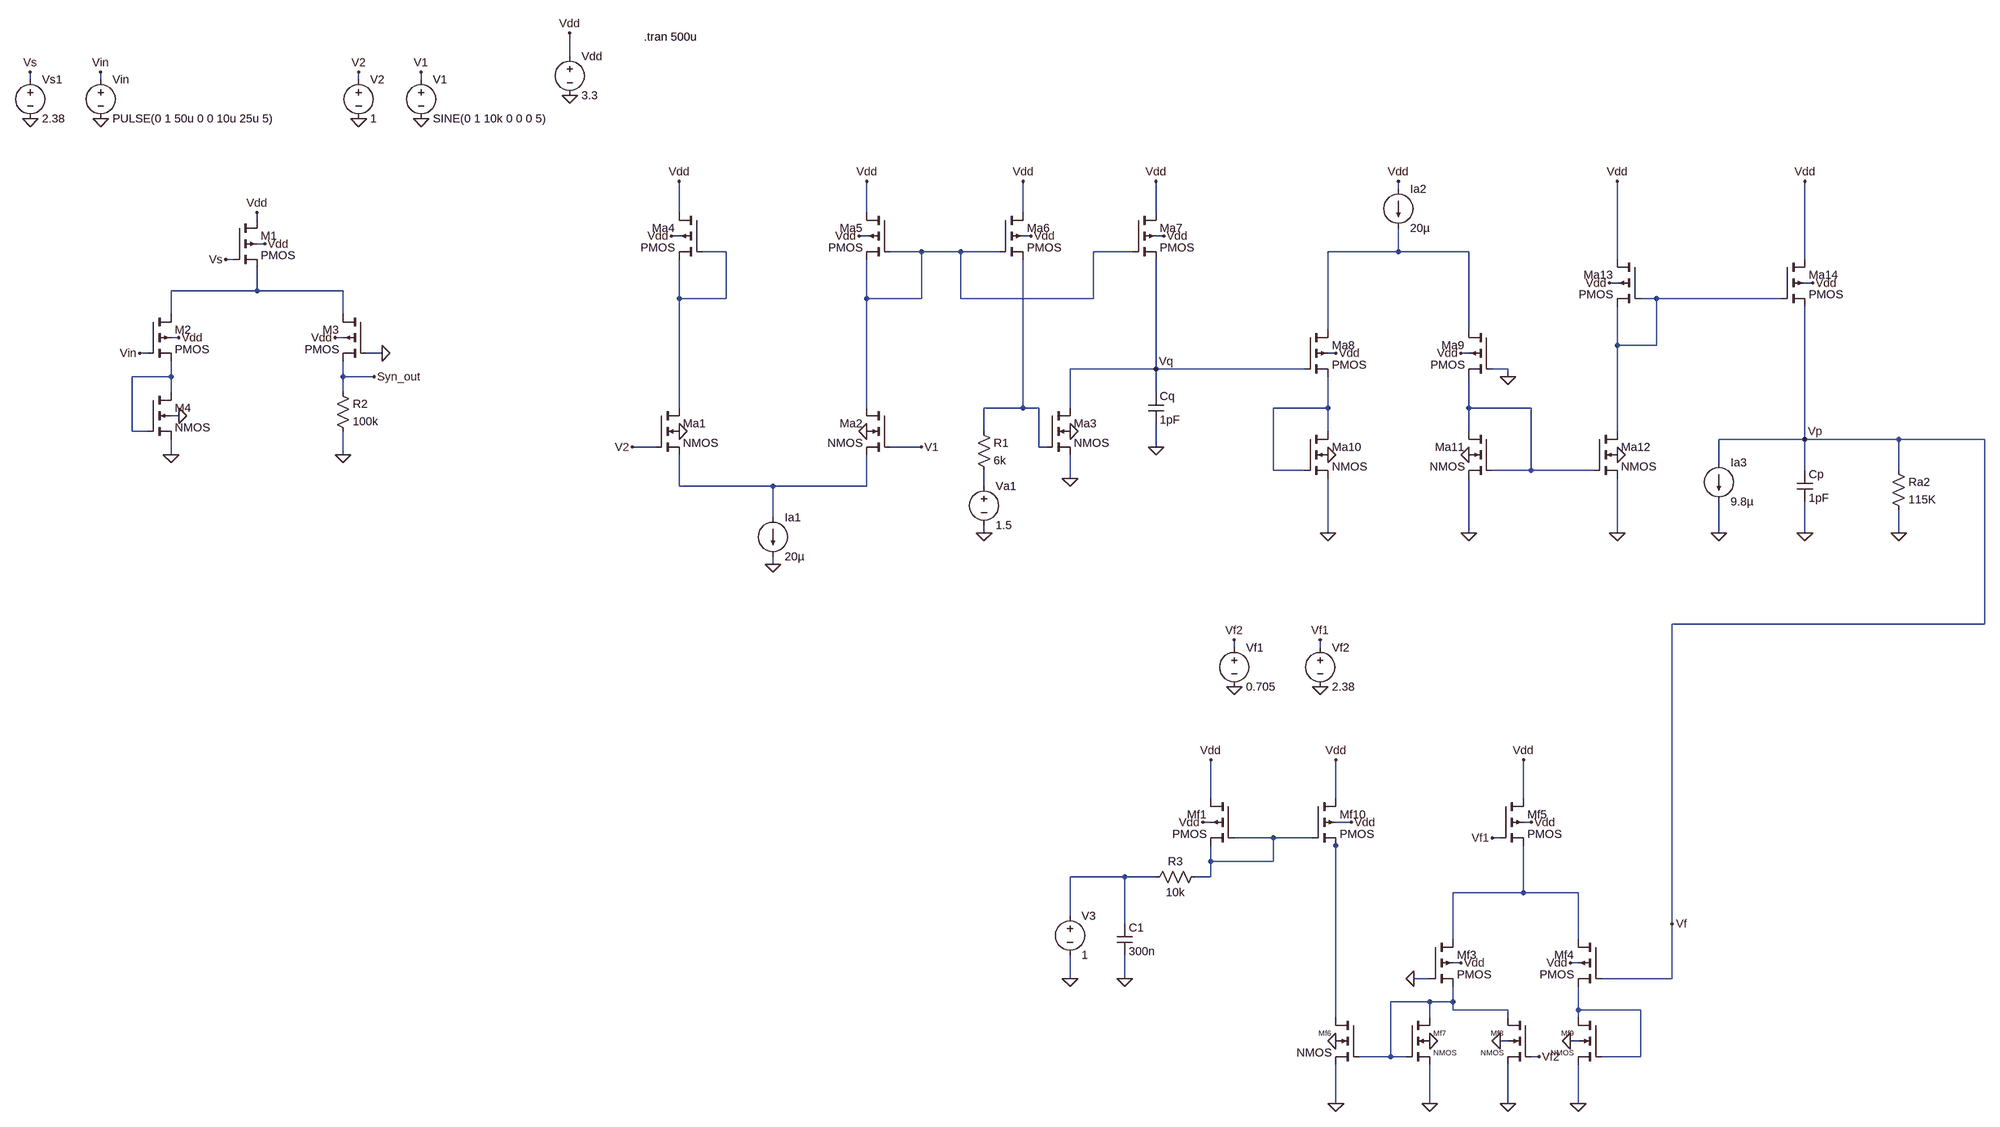
[diagram p0: schematic Astrocyte(l=50n).asc]
Astrocyte(l=50n).asc, the LTspice schematic file:
Version 4
SHEET 1 2788 2352
WIRE -112 -160 -112 -208
WIRE -1216 -112 -1216 -128
WIRE -1072 -112 -1072 -128
WIRE -544 -112 -544 -128
WIRE -416 -112 -416 -128
WIRE 1584 112 1584 96
WIRE 112 160 112 96
WIRE 496 160 496 96
WIRE 816 160 816 96
WIRE 1088 160 1088 96
WIRE -752 176 -752 160
WIRE 112 208 96 208
WIRE 496 208 480 208
WIRE 832 208 816 208
WIRE 1104 208 1088 208
WIRE -736 224 -752 224
WIRE 208 240 160 240
WIRE 608 240 544 240
WIRE 688 240 608 240
WIRE 768 240 688 240
WIRE 1040 240 960 240
WIRE 1584 240 1584 192
WIRE 1584 240 1440 240
WIRE 1728 240 1584 240
WIRE -800 256 -816 256
WIRE 2032 256 2032 96
WIRE 2416 256 2416 96
WIRE 2032 304 2016 304
WIRE 2432 304 2416 304
WIRE -752 320 -752 272
WIRE -752 320 -928 320
WIRE -576 320 -752 320
WIRE 112 336 112 256
WIRE 208 336 208 240
WIRE 208 336 112 336
WIRE 496 336 496 256
WIRE 608 336 608 240
WIRE 608 336 496 336
WIRE 688 336 688 240
WIRE 960 336 960 240
WIRE 960 336 688 336
WIRE 2112 336 2080 336
WIRE 2368 336 2112 336
WIRE -928 368 -928 320
WIRE -576 368 -576 320
WIRE 1440 400 1440 240
WIRE 1728 400 1728 240
WIRE -912 416 -928 416
WIRE -576 416 -592 416
WIRE 2032 432 2032 352
WIRE 2112 432 2112 336
WIRE 2112 432 2032 432
WIRE -976 448 -992 448
WIRE -496 448 -528 448
WIRE 1456 448 1440 448
WIRE 1728 448 1712 448
WIRE 1088 480 1088 256
WIRE 1088 480 912 480
WIRE 1392 480 1088 480
WIRE 1808 480 1776 480
WIRE -928 496 -928 464
WIRE -928 496 -1008 496
WIRE -576 496 -576 464
WIRE -512 496 -576 496
WIRE 1808 496 1808 480
WIRE -928 528 -928 496
WIRE -576 528 -576 496
WIRE 1088 528 1088 480
WIRE 112 560 112 336
WIRE 496 560 496 336
WIRE 816 560 816 256
WIRE 816 560 736 560
WIRE 848 560 816 560
WIRE 912 560 912 480
WIRE 1440 560 1440 496
WIRE 1440 560 1328 560
WIRE 1728 560 1728 496
WIRE 1856 560 1728 560
WIRE -912 576 -928 576
WIRE -1008 608 -1008 496
WIRE -976 608 -1008 608
WIRE 736 608 736 560
WIRE 1440 608 1440 560
WIRE 1728 608 1728 560
WIRE 2032 608 2032 432
WIRE 2416 624 2416 352
WIRE 2416 624 2240 624
WIRE 2608 624 2416 624
WIRE 2784 624 2608 624
WIRE 64 640 16 640
WIRE 608 640 544 640
WIRE 848 640 848 560
WIRE 864 640 848 640
WIRE 1088 640 1088 592
WIRE -928 656 -928 624
WIRE -576 656 -576 608
WIRE 2240 672 2240 624
WIRE 1328 688 1328 560
WIRE 1392 688 1328 688
WIRE 1856 688 1856 560
WIRE 1856 688 1776 688
WIRE 1984 688 1856 688
WIRE 2416 688 2416 624
WIRE 2608 688 2608 624
WIRE 912 704 912 656
WIRE 112 720 112 656
WIRE 304 720 112 720
WIRE 496 720 496 656
WIRE 496 720 304 720
WIRE 736 720 736 688
WIRE 304 784 304 720
WIRE 736 816 736 800
WIRE 1440 816 1440 704
WIRE 1728 816 1728 704
WIRE 2032 816 2032 704
WIRE 2240 816 2240 752
WIRE 2416 816 2416 752
WIRE 2608 816 2608 768
WIRE 304 880 304 864
WIRE 2784 1296 2784 624
WIRE 2784 1296 2144 1296
WIRE 1248 1344 1248 1328
WIRE 1424 1344 1424 1328
WIRE 1200 1712 1200 1632
WIRE 1456 1712 1456 1632
WIRE 1840 1712 1840 1632
WIRE 1200 1760 1184 1760
WIRE 1488 1760 1456 1760
WIRE 1856 1760 1840 1760
WIRE 1328 1792 1248 1792
WIRE 1408 1792 1328 1792
WIRE 1792 1792 1776 1792
WIRE 1456 1808 1456 1792
WIRE 1200 1840 1200 1808
WIRE 1328 1840 1328 1792
WIRE 1328 1840 1200 1840
WIRE 1024 1872 912 1872
WIRE 1088 1872 1024 1872
WIRE 1200 1872 1200 1840
WIRE 1200 1872 1168 1872
WIRE 1840 1904 1840 1808
WIRE 1840 1904 1696 1904
WIRE 1952 1904 1840 1904
WIRE 912 1952 912 1872
WIRE 1024 1968 1024 1872
WIRE 2144 1968 2144 1296
WIRE 1696 2000 1696 1904
WIRE 1952 2000 1952 1904
WIRE 1712 2048 1696 2048
WIRE 1952 2048 1936 2048
WIRE 912 2080 912 2032
WIRE 1024 2080 1024 2032
WIRE 1648 2080 1616 2080
WIRE 2144 2080 2144 1968
WIRE 2144 2080 2000 2080
WIRE 1648 2128 1568 2128
WIRE 1696 2128 1696 2096
WIRE 1696 2128 1648 2128
WIRE 1696 2144 1696 2128
WIRE 1808 2144 1696 2144
WIRE 1952 2144 1952 2096
WIRE 2080 2144 1952 2144
WIRE 1456 2160 1456 1808
WIRE 1648 2160 1648 2128
WIRE 1808 2160 1808 2144
WIRE 1952 2160 1952 2144
WIRE 1808 2208 1792 2208
WIRE 1952 2208 1936 2208
WIRE 1568 2240 1568 2128
WIRE 1568 2240 1504 2240
WIRE 1600 2240 1568 2240
WIRE 1872 2240 1856 2240
WIRE 2080 2240 2080 2144
WIRE 2080 2240 2000 2240
WIRE 1456 2336 1456 2256
WIRE 1648 2336 1648 2256
WIRE 1808 2336 1808 2256
WIRE 1952 2336 1952 2256
FLAG 112 608 0
FLAG 912 608 0
FLAG 1088 640 0
FLAG 912 704 0
FLAG 736 816 0
FLAG 1808 496 0
FLAG 2608 816 0
FLAG 2416 816 0
FLAG 2240 816 0
FLAG 1728 816 0
FLAG 1440 816 0
FLAG 1088 480 Vq
FLAG 496 608 0
FLAG 2032 656 0
FLAG 1728 656 0
FLAG 1440 656 0
FLAG 608 640 V1
FLAG 16 640 V2
FLAG 304 880 0
FLAG 2032 816 0
FLAG 112 96 Vdd
FLAG 496 96 Vdd
FLAG 816 96 Vdd
FLAG 1088 96 Vdd
FLAG 96 208 Vdd
FLAG 480 208 Vdd
FLAG 832 208 Vdd
FLAG 1584 96 Vdd
FLAG 1456 448 Vdd
FLAG 1712 448 Vdd
FLAG 2032 96 Vdd
FLAG 2416 96 Vdd
FLAG 2016 304 Vdd
FLAG 2432 304 Vdd
FLAG 1104 208 Vdd
FLAG -112 -80 0
FLAG -112 -208 Vdd
FLAG 2416 624 Vp
FLAG -912 576 0
FLAG -816 256 Vs
FLAG -752 160 Vdd
FLAG -496 448 0
FLAG -576 656 0
FLAG -928 656 0
FLAG -512 496 Syn_out
FLAG -992 448 Vin
FLAG -1216 -32 0
FLAG -1072 -32 0
FLAG -1216 -128 Vs
FLAG -1072 -128 Vin
FLAG -736 224 Vdd
FLAG -912 416 Vdd
FLAG -592 416 Vdd
FLAG 1456 2336 0
FLAG 1648 2336 0
FLAG 1952 2336 0
FLAG 1808 2336 0
FLAG 1936 2208 0
FLAG 1792 2208 0
FLAG 1648 2208 0
FLAG 1456 2208 0
FLAG 1616 2080 0
FLAG 1872 2240 Vf2
FLAG 1776 1792 Vf1
FLAG 1840 1632 Vdd
FLAG 1456 1632 Vdd
FLAG 1200 1632 Vdd
FLAG 1712 2048 Vdd
FLAG 1936 2048 Vdd
FLAG 1184 1760 Vdd
FLAG 1856 1760 Vdd
FLAG 2144 1968 Vf
FLAG 1424 1424 0
FLAG 1248 1424 0
FLAG 1248 1328 Vf2
FLAG 1424 1328 Vf1
FLAG -544 -32 0
FLAG -544 -128 V2
FLAG -416 -32 0
FLAG -416 -128 V1
FLAG 1488 1760 Vdd
FLAG 1024 2080 0
FLAG 912 2080 0
SYMBOL nmos4 64 560 R0
SYMATTR InstName Ma1
SYMATTR Value2 l=250n w=45n
SYMBOL nmos4 864 560 R0
SYMATTR InstName Ma3
SYMATTR Value2 l=250n w=50n
SYMBOL cap 1072 528 R0
SYMATTR InstName Cq
SYMATTR Value 1pF
SYMBOL res 720 592 R0
SYMATTR InstName R1
SYMATTR Value 6k
SYMBOL voltage 736 704 R0
SYMATTR InstName Va1
SYMATTR Value 1.5
SYMBOL nmos4 1392 608 R0
SYMATTR InstName Ma10
SYMATTR Value2 l=50n w=500n
SYMBOL pmos4 160 160 M0
SYMATTR InstName Ma4
SYMATTR Value2 l=50n w=500n
SYMBOL pmos4 1392 400 R0
SYMATTR InstName Ma8
SYMATTR Value2 l=50n w=500n
SYMBOL pmos4 2080 256 M0
SYMATTR InstName Ma13
SYMATTR Value2 l=50n w=460n
SYMBOL pmos4 2368 256 R0
SYMATTR InstName Ma14
SYMATTR Value2 l=50n w=460n
SYMBOL cap 2400 688 R0
SYMATTR InstName Cp
SYMATTR Value 1pF
SYMBOL res 2592 672 R0
SYMATTR InstName Ra2
SYMATTR Value 115K
SYMBOL current 304 784 R0
SYMATTR InstName Ia1
SYMATTR Value 20µ
SYMBOL current 1584 112 R0
SYMATTR InstName Ia2
SYMATTR Value 20µ
SYMBOL current 2240 672 R0
SYMATTR InstName Ia3
SYMATTR Value 9.8µ
SYMBOL pmos4 544 160 M0
SYMATTR InstName Ma5
SYMATTR Value2 l=50n w=500n
SYMBOL pmos4 768 160 R0
SYMATTR InstName Ma6
SYMATTR Value2 l=50n w=500n
SYMBOL pmos4 1040 160 R0
SYMATTR InstName Ma7
SYMATTR Value2 l=50n w=500n
SYMBOL nmos4 544 560 M0
SYMATTR InstName Ma2
SYMATTR Value2 l=250n w=45n
SYMBOL nmos4 1776 608 M0
SYMATTR InstName Ma11
SYMATTR Value2 l=50n w=500n
SYMBOL nmos4 1984 608 R0
SYMATTR InstName Ma12
SYMATTR Value2 l=50n w=500n
SYMBOL voltage -112 -176 R0
SYMATTR InstName Vdd
SYMATTR Value 3.3
SYMBOL pmos4 1776 400 M0
SYMATTR InstName Ma9
SYMATTR Value2 l=50n w=500n
SYMBOL pmos4 -800 176 R0
SYMATTR InstName M1
SYMATTR Value2 l=50n w=500n
SYMBOL pmos4 -976 368 R0
SYMATTR InstName M2
SYMATTR Value2 l=50n w=5n
SYMBOL pmos4 -528 368 M0
SYMATTR InstName M3
SYMATTR Value2 l=50n w=5n
SYMBOL nmos4 -976 528 R0
SYMATTR InstName M4
SYMATTR Value2 l=50n w=500n
SYMBOL res -592 512 R0
SYMATTR InstName R2
SYMATTR Value 100k
SYMBOL voltage -1216 -128 R0
SYMATTR InstName Vs1
SYMATTR Value 2.38
SYMBOL voltage -1072 -128 R0
SYMATTR InstName Vin
SYMATTR Value PULSE(0 1 50u 0 0 10u 25u 5)
SYMBOL pmos4 1248 1712 M0
SYMATTR InstName Mf1
SYMATTR Value2 l=50n w=500n
SYMBOL pmos4 1648 2000 R0
SYMATTR InstName Mf3
SYMATTR Value2 l=50u w=500u
SYMBOL pmos4 2000 2000 M0
SYMATTR InstName Mf4
SYMATTR Value2 l=50u w=500u
SYMBOL pmos4 1792 1712 R0
SYMATTR InstName Mf5
SYMATTR Value2 l=50u w=475u
SYMBOL nmos4 1504 2160 M0
WINDOW 0 56 32 Left 1
SYMATTR InstName Mf6
SYMATTR Value2 l=50n w=250n
SYMBOL nmos4 1600 2160 R0
WINDOW 0 56 32 Left 1
WINDOW 3 56 72 Left 1
SYMATTR InstName Mf7
SYMATTR Value2 l=50n w=250n
SYMBOL nmos4 1856 2160 M0
WINDOW 0 56 32 Left 1
WINDOW 3 56 72 Left 1
SYMATTR InstName Mf8
SYMATTR Value2 l=50n w=250n
SYMBOL nmos4 2000 2160 M0
WINDOW 0 56 32 Left 1
WINDOW 3 56 72 Left 1
SYMATTR InstName Mf9
SYMATTR Value2 l=50n w=250n
SYMBOL voltage 1248 1328 R0
SYMATTR InstName Vf1
SYMATTR Value 0.705
SYMBOL voltage 1424 1328 R0
SYMATTR InstName Vf2
SYMATTR Value 2.38
SYMBOL voltage -544 -128 R0
SYMATTR InstName V2
SYMATTR Value 1
SYMBOL voltage -416 -128 R0
SYMATTR InstName V1
SYMATTR Value SINE(0 1 10k 0 0 0 5)
SYMBOL pmos4 1408 1712 R0
SYMATTR InstName Mf10
SYMATTR Value2 l=50n w=500n
SYMBOL cap 1008 1968 R0
SYMATTR InstName C1
SYMATTR Value 300n
SYMBOL voltage 912 1936 R0
SYMATTR InstName V3
SYMATTR Value 1
SYMBOL res 1184 1856 R90
WINDOW 0 0 56 VBottom 2
WINDOW 3 32 56 VTop 2
SYMATTR InstName R3
SYMATTR Value 10k
TEXT 40 -200 Left 2 !.tran 500u

The netlist it stands for:
* Astrocyte(l=50n).asc
Ma1 N001 V2 N010 0 NMOS l=250n w=45n
Ma3 Vq N007 0 0 NMOS l=250n w=50n
Cq Vq 0 1pF
R1 N007 N011 6k
Va1 N011 0 1.5
Ma10 N008 N008 0 0 NMOS l=50n w=500n
Ma4 Vdd N001 N001 Vdd PMOS l=50n w=500n
Ma8 N003 Vq N008 Vdd PMOS l=50n w=500n
Ma13 Vdd N005 N005 Vdd PMOS l=50n w=460n
Ma14 Vdd N005 Vf Vdd PMOS l=50n w=460n
Cp Vf 0 1pF
Ra2 Vf 0 115K
Ia1 N010 0 20µ
Ia2 Vdd N003 20µ
Ia3 Vf 0 9.8µ
Ma5 Vdd N002 N002 Vdd PMOS l=50n w=500n
Ma6 Vdd N002 N007 Vdd PMOS l=50n w=500n
Ma7 Vdd N002 Vq Vdd PMOS l=50n w=500n
Ma2 N002 V1 N010 0 NMOS l=250n w=45n
Ma11 N009 N009 0 0 NMOS l=50n w=500n
Ma12 N005 N009 0 0 NMOS l=50n w=500n
Vdd Vdd 0 3.3
Ma9 N003 0 N009 Vdd PMOS l=50n w=500n
M1 Vdd Vs N004 Vdd PMOS l=50n w=500n
M2 N004 Vin N006 Vdd PMOS l=50n w=5n
M3 N004 0 Syn_out Vdd PMOS l=50n w=5n
M4 N006 N006 0 0 NMOS l=50n w=500n
R2 Syn_out 0 100k
Vs1 Vs 0 2.38
Vin Vin 0 PULSE(0 1 50u 0 0 10u 25u 5)
Mf1 Vdd N012 N012 Vdd PMOS l=50n w=500n
Mf3 N015 0 N016 Vdd PMOS l=50u w=500u
Mf4 N015 Vf N017 Vdd PMOS l=50u w=500u
Mf5 Vdd Vf1 N015 Vdd PMOS l=50u w=475u
Mf6 N013 N016 0 0 NMOS l=50n w=250n
Mf7 N016 N016 0 0 NMOS l=50n w=250n
Mf8 N016 Vf2 0 0 NMOS l=50n w=250n
Mf9 N017 N017 0 0 NMOS l=50n w=250n
Vf1 Vf2 0 0.705
Vf2 Vf1 0 2.38
V2 V2 0 1
V1 V1 0 SINE(0 1 10k 0 0 0 5)
Mf10 Vdd N012 N013 Vdd PMOS l=50n w=500n
C1 N014 0 300n
V3 N014 0 1
R3 N012 N014 10k
.model NMOS NMOS
.model PMOS PMOS
.lib standard.mos
.tran 500u
.backanno
.end